# EAGLE design arduino (EAGLE 6.4)
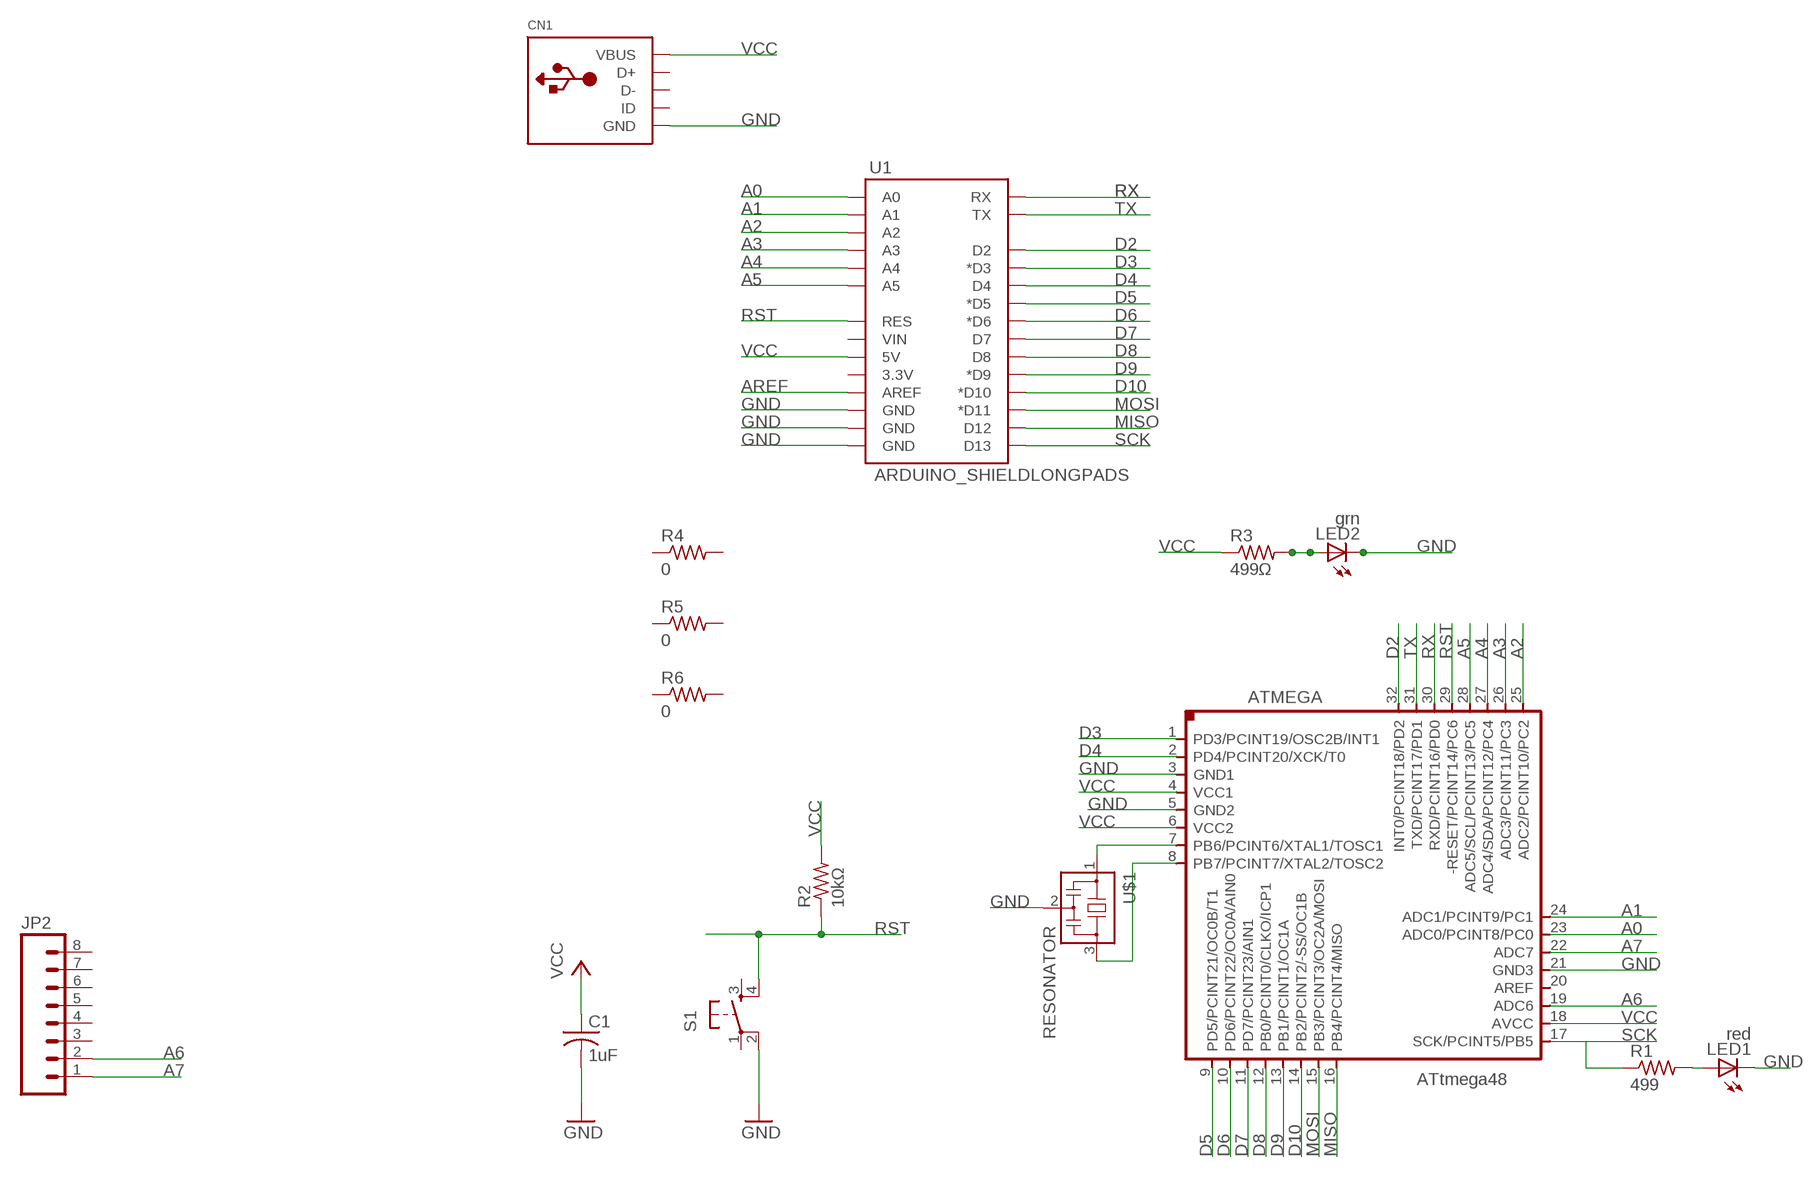
[diagram p0: schematic, sheet 1]

## Parts
ATMEGA  328p-au  ATMEGA48TQFP  [TQFP32-08]
C1  1uF  C-USC1206  [C1206]
CN1  USBMINIB  [USB-MINIB]
JP2  M08LOCK_LONGPADS  [1X08_LOCK_LONGPADS]
LED1  red  LEDCHIPLED_1206  [CHIPLED_1206]
LED2  grn  LEDCHIPLED_1206  [CHIPLED_1206]
R1  499  R-US_R1206  [R1206]
R2  10kΩ  R-US_M1206  [M1206]
R3  499Ω  R-US_M1206  [M1206]
R4  0  R-US_M1206  [M1206]
R5  0  R-US_M1206  [M1206]
R6  0  R-US_M1206  [M1206]
S1  6MM_SWITCH6MM_SWITCH  [6MM_SWITCH]
U1  ARDUINO_SHIELDLONGPADS  [DUEMILANOVE_SHIELD_LONGPADS]
U$1  RESONATOR  [EFOBM]

## Nets
A0: ATMEGA.23(ADC0/PCINT8/PC0) U1.A0
A1: ATMEGA.24(ADC1/PCINT9/PC1) U1.A1
A2: ATMEGA.25(ADC2/PCINT10/PC2) U1.A2
A3: ATMEGA.26(ADC3/PCINT11/PC3) U1.A3
A4: ATMEGA.27(ADC4/SDA/PCINT12/PC4) U1.A4
A5: ATMEGA.28(ADC5/SCL/PCINT13/PC5) U1.A5
A6: ATMEGA.19(ADC6) JP2.2
A7: ATMEGA.22(ADC7) JP2.1
AREF: U1.AREF
D2: ATMEGA.32(INT0/PCINT18/PD2) U1.D2
D3: ATMEGA.1(PD3/PCINT19/OSC2B/INT1) U1.D3(*D3)
D4: ATMEGA.2(PD4/PCINT20/XCK/T0) U1.D4
D5: ATMEGA.9(PD5/PCINT21/OC0B/T1) U1.D5(*D5)
D6: ATMEGA.10(PD6/PCINT22/OC0A/AIN0) U1.D6(*D6)
D7: ATMEGA.11(PD7/PCINT23/AIN1) U1.D7
D8: ATMEGA.12(PB0/PCINT0/CLKO/ICP1) U1.D8
D9: ATMEGA.13(PB1/PCINT1/OC1A) U1.D9(*D9)
D10: ATMEGA.14(PB2/PCINT2/-SS/OC1B) U1.D10(*D10)
GND: ATMEGA.3(GND1) ATMEGA.5(GND2) ATMEGA.21(GND3) C1.2 CN1.GND LED1.C LED2.C S1.2(P1) U1.GND@0(GND) U1.GND@1(GND) U1.GND@2(GND) U$1.2
MISO: ATMEGA.16(PB4/PCINT4/MISO) U1.D12
MOSI: ATMEGA.15(PB3/PCINT3/OC2A/MOSI) U1.D11(*D11)
N$2: LED1.A R1.2
N$5: ATMEGA.7(PB6/PCINT6/XTAL1/TOSC1) U$1.1
N$6: ATMEGA.8(PB7/PCINT7/XTAL2/TOSC2) U$1.3
N$7: LED2.A R3.2
RST: ATMEGA.29(-RESET/PCINT14/PC6) R2.1 S1.4(S1) U1.RES
RX: ATMEGA.30(RXD/PCINT16/PD0) U1.RX
SCK: ATMEGA.17(SCK/PCINT5/PB5) R1.1 U1.D13
TX: ATMEGA.31(TXD/PCINT17/PD1) U1.TX
VCC: ATMEGA.4(VCC1) ATMEGA.6(VCC2) ATMEGA.18(AVCC) C1.1 CN1.VBUS R2.2 R3.1 U1.5V
Unconnected: ATMEGA.20(AREF) CN1.D+ CN1.D- CN1.ID JP2.3 JP2.4 JP2.5 JP2.6 JP2.7 JP2.8 R4.1 R4.2 R5.1 R5.2 R6.1 R6.2 S1.1(P) S1.3(S) U1.3.3V U1.VIN

## Library data of the parts
ATMEGA = 01_ng:ATMEGA48
C1 = 01_adafruit:C-US: CAPACITOR, American symbol
CN1 = 01_adafruit:USB: USB Connectors USBMINIB - Surface Mount Female Mini-B USB Connector 4UConnector: 06564 By microbuilder.eu Thru-hole RA Female Mini-B USB Connector 4UConnector: 18732 By ladyada.net
JP2 = 01_SparkFun:M08: Header 8 Standard 8-pin 0.1" header. Use with straight break away headers (SKU : PRT-00116), right angle break away headers (PRT-00553), swiss pins (PRT-00743), machine pins (PRT-00117), and female headers (PRT-00115).
LED1 LED2 = 01_adafruit:LED: LED OSRAM: - CHIPLED LG R971, LG N971, LY N971, LG Q971, LY Q971, LO R971, LY R971 LH N974, LH R974 LS Q976, LO Q976, LY Q976 LO Q996 - Hyper CHIPLED LW Q18S LB Q993, LB Q99A, LB R99A - SideLED LS A670, LO A670, LY A670, LG A670, LP A670 LB A673, LV A673, LT A673, LW A673 LH A674 LY A675 LS A676, LA A676, LO A676, LY A676, LW A676 LS A679, LY A679, LG A679 - Hyper Micro SIDELED® LS Y876, LA Y876, LO Y876, LY Y876 LT Y87S - SmartLED LW L88C, LW L88S LB L89C, LB L89S, LG L890 LS L89K, LO L89K, LY L89K LS L896, LA L896, LO L896, LY L896 - TOPLED LS T670, LO T670, LY T670, LG T670, LP T670 LSG T670, LSP T670, LSY T670, LOP T670, LYG T670 LG T671, LOG T671, LSG T671 LB T673, LV T673, LT T673, LW T673 LH T674 LS T676, LA T676, LO T676, LY T676, LB T676, LH T676, LSB T676, LW T676 LB T67C, LV T67C, LT T67C, LS T67K, LO T67K, LY T67K, LW E67C LS E67B, LA E67B, LO E67B, LY E67B, LB E67C, LV E67C, LT E67C LW T67C LS T679, LY T679, LG T679 LS T770, LO T770, LY T770, LG T770, LP T770 LB T773, LV T773, LT T773, LW T773 LH T774 LS E675, LA E675, LY E675, LS T675 LS T776, LA T776, LO T776, LY T776, LB T776 LHGB T686 LT T68C, LB T68C - Hyper Mini TOPLED® LB M676 - Mini TOPLED Santana® LG M470 LS M47K, LO M47K, LY M47K Source: http://www.osram.convergy.de/
R1-R6 = 01_adafruit:R-US_: RESISTOR, American symbol
S1 = 01_FAB_Hello:6MM_SWITCH: OMRON SWITCH
U1 = SparkFun-Boards:ARDUINO_SHIELD: Arduino shield footprint
U$1 = 01_fab:RESONATOR

## Board
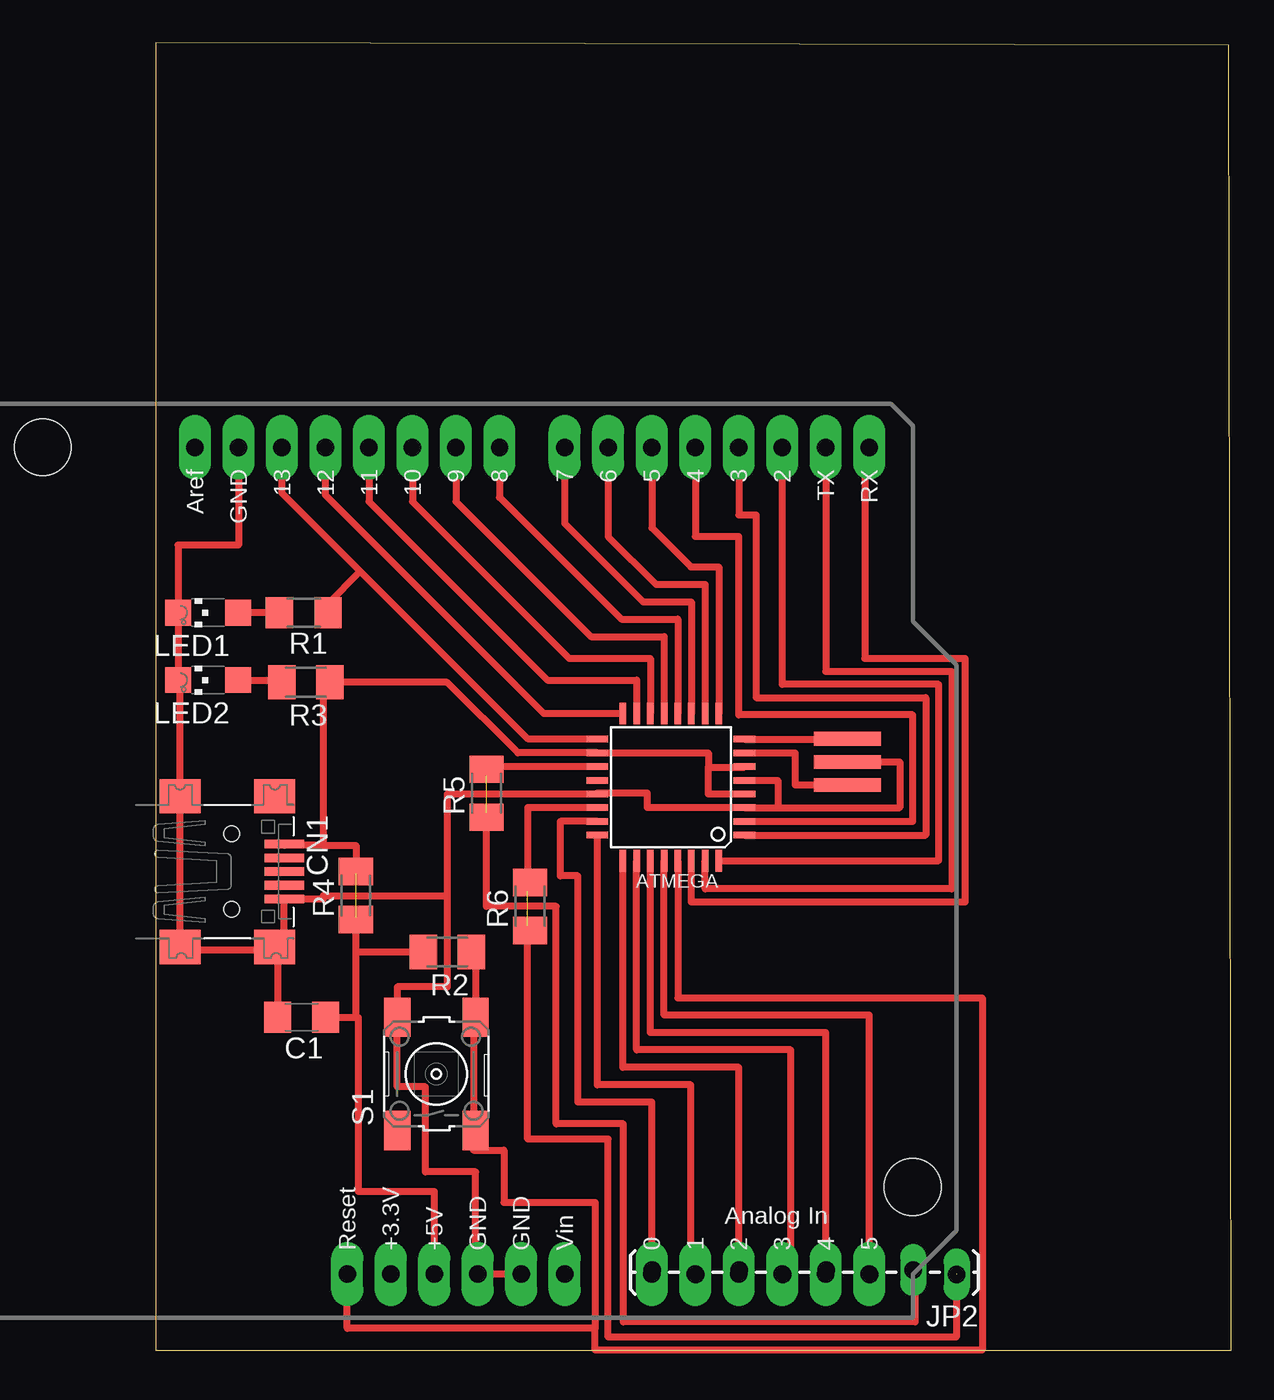
[diagram p1: board, top side]

Size 62.79 x 76.32 mm. Coordinates in mm from the lower left corner, seen from the top.
Outline: 0,0 62.79,0 62.66,76.19 0,76.32 0,0
Copper layers (1*16): Top 0.035mm / dielectric 1.5mm / Bottom 0.035mm
Design rules "default": minimum track width 10mil, minimum drill 24mil, track to track 8mil, track to pad 8mil, pad to pad 8mil, via to via 8mil, smd to smd 8mil, copper to edge 40mil, drill to drill 8mil, minimum pad ring 10mil, minimum via ring 8mil, stop-mask expansion 4mil, vias tented up to drill 0mil, thermal gap 10mil

### Footprints (pad centres in the part's own frame; a part is rotated, then mirrored left to right if it is on the bottom)
TQFP32-08 = smd 1.27 x 0.381: 1 -4.293,2.8; 2 -4.293,2; 3 -4.293,1.2; 4 -4.293,0.4; 5 -4.293,-0.4; 6 -4.293,-1.2; 7 -4.293,-2; 8 -4.293,-2.8; 17 4.293,-2.8; 18 4.293,-2; 19 4.293,-1.2; 20 4.293,-0.4; 21 4.293,0.4; 22 4.293,1.2; 23 4.293,2; 24 4.293,2.8 | smd 0.381 x 1.27: 9 -2.8,-4.293; 10 -2,-4.293; 11 -1.2,-4.293; 12 -0.4,-4.293; 13 0.4,-4.293; 14 1.2,-4.293; 15 2,-4.293; 16 2.8,-4.293; 25 2.8,4.293; 26 2,4.293; 27 1.2,4.293; 28 0.4,4.293; 29 -0.4,4.293; 30 -1.2,4.293; 31 -2,4.293; 32 -2.8,4.293
C1206 = smd 1.6 x 1.8: 1 -1.4,0; 2 1.4,0
USB-MINIB = smd 0.5 x 2.308: D+ 0,4.064; D- -0.8,4.064; GND 1.6,4.064; ID 0.8,4.064; VBUS -1.6,4.064 | smd 2 x 2.4: GND1 -4.4,-2; GND2 -4.4,3.5; GND3 4.4,3.5; GND4 4.4,-2 | hole 0.9: -2.2,1; 2.2,1
1X08_LOCK_LONGPADS = drill 1.016 long: 1 0,0.127; 2 2.54,-0.127; 3 5.08,0.127; 4 7.62,-0.127; 5 10.16,0.127; 6 12.7,-0.127; 7 15.24,0.127; 8 17.78,-0.127
CHIPLED_1206 = smd 1.5 x 1.5: A 0,-1.75; C 0,1.75
R1206 = smd 1.6 x 1.803: 1 -1.422,0; 2 1.422,0
M1206 = smd 1.6 x 2: 1 -1.4,0; 2 1.4,0
6MM_SWITCH = smd 2.286 x 1.524: 1 -3.302,2.286; 2 3.302,2.286; 3 -3.302,-2.286; 4 3.302,-2.286
DUEMILANOVE_SHIELD_LONGPADS = drill 1.016 pad 1.88 long: 3.3V 50.8,26.67; 5V 50.8,29.21; A0 50.8,41.91; A1 50.8,44.45; A2 50.8,46.99; A3 50.8,49.53; A4 50.8,52.07; A5 50.8,54.61; AREF 2.54,15.24; D2 2.54,49.53; D3 2.54,46.99; D4 2.54,44.45; D5 2.54,41.91; D6 2.54,39.37; D7 2.54,36.83; D8 2.54,33.02; D9 2.54,30.48; D10 2.54,27.94; D11 2.54,25.4; D12 2.54,22.86; D13 2.54,20.32; GND@0 50.8,31.75; GND@1 50.8,34.29; GND@2 2.54,17.78; RES 50.8,24.13; RX 2.54,54.61; TX 2.54,52.07; VIN 50.8,36.83 | hole 3.302: 45.72,57.15; 2.54,6.35
EFOBM = smd 0.8 x 3.9: 1 -1.35,0; 2 0,0; 3 1.35,0

### Placement (x,y rotation side)
ATMEGA  30.07,32.87 180 top
C1  8.51,19.43 180 top
CN1  3.43,27.94 270 top
JP2  46.76,4.55 180 top
LED1  3.05,43.05 90 top
LED2  3.05,39.12 90 top
R1  8.64,43.05 180 top
R2  17.02,23.24 180 top
R3  8.76,38.99 180 top
R4  11.68,26.54 90 top
R5  19.3,32.51 90 top
R6  21.84,25.91 90 top
S1  16.38,16.13 90 top
U1  -12.95,55.24 270 top
U$1  40.39,34.34 90 top

### Tracks (layer width: path | path; a pad name or v marks a point on that pad's centre or on a via)
A0
  Top 0.406: U1.A0 28.96,14.48 24.64,14.48 24.64,27.69 23.62,27.69 23.62,30.87 ATMEGA.23
A1
  Top 0.406: U1.A1 31.24,4.45 31.24,15.49 25.78,15.49 ATMEGA.24
A2
  Top 0.406: U1.A2 34.04,16.51 27.27,16.51 ATMEGA.25
A3
  Top 0.406: U1.A3 37.08,4.45 37.08,17.53 28.07,17.53 ATMEGA.26
A4
  Top 0.406: U1.A4 39.12,18.54 28.87,18.54 ATMEGA.27
A5
  Top 0.406: U1.A5 41.66,19.56 29.67,19.56 ATMEGA.28
A6  (1 unrouted)
  Top 0.406: ATMEGA.19 19.18,34.07 19.18,34.04 19.3,34.04 19.3,33.53 | JP2.2 44.32,4.67 44.32,1.65 27.3,1.65 27.3,13.21 23.37,13.21 23.37,25.91 19.3,25.91 19.3,31.37
A7  (2 unrouted)
  Top 0.406: 46.74,4.42 46.74,4.45 | ATMEGA.22 21.72,31.67 21.72,26.8 | JP2.1 46.74,4.42 | 46.74,4.42 46.74,0.76 26.42,0.76 26.42,12.32 21.72,12.32 21.72,24.77
D2
  Top 0.406: ATMEGA.32 45.72,28.57 45.72,38.86 36.58,38.86 U1.D2
D3
  Top 0.406: 34.04,52.83 U1.D3 34.04,48.77 35.05,48.77 35.05,38.1 44.96,38.1 44.96,30.07 ATMEGA.1
D4
  Top 0.406: U1.D4 31.5,47.5 34.04,47.5 34.04,37.08 44.2,37.08 44.2,30.87 ATMEGA.2
D5
  Top 0.406: U1.D5 28.96,48.01 31.24,45.72 32.87,45.72 ATMEGA.9
D6
  Top 0.406: U1.D6 26.42,47.5 29.21,44.7 32.07,44.7 ATMEGA.10
D7
  Top 0.406: U1.D7 23.88,48.26 28.45,43.69 31.27,43.69 ATMEGA.11
D8
  Top 0.406: U1.D8 20.07,49.78 27.18,42.67 30.47,42.67 ATMEGA.12
D9
  Top 0.406: U1.D9 17.53,49.53 25.4,41.66 29.67,41.66 ATMEGA.13
D10
  Top 0.406: U1.D10 14.99,49.53 24.13,40.39 28.87,40.39 ATMEGA.14
GND
  Top 0.406: U1.GND@1 U1.GND@0 18.8,4.83 18.67,4.83 18.67,10.41 15.75,10.41 15.75,15.37 14.1,15.37 S1.2 14.1,21.21 17.02,21.21 17.02,26.54 | 7.11,23.37 1.4,23.37 1.4,39.12 LED2.C LED1.C 1.3,46.99 4.83,46.99 U1.GND@2 | 7.11,23.37 7.49,23.37 CN1.GND 9.78,26.34 9.78,26.54 17.02,26.54 | 7.11,23.37 C1.2 | 17.02,26.54 17.02,32.47 ATMEGA.21 25.78,32.51 28.7,32.51 28.7,31.67 ATMEGA.3 36.32,31.67 | U$1.2 43.43,34.34 43.43,31.67 36.32,31.67 | ATMEGA.5 36.32,33.27 36.32,31.67
MISO
  Top 0.406: ATMEGA.16 22.66,37.16 9.91,49.91 U1.D12
MOSI
  Top 0.406: U1.D11 12.45,49.53 22.86,39.12 28.07,39.12 ATMEGA.15
N$2
  Top 0.406: R1.2 LED1.A
N$5
  Top 0.406: U$1.1 37.34,32.99 37.34,34.87 ATMEGA.7
N$6
  Top 0.406: ATMEGA.8 40.39,35.67 U$1.3
N$7
  Top 0.406: LED2.A 7.24,39.12 R3.2
RST
  Top 0.406: S1.4 18.67,23.24 R2.1 18.8,23.24 18.8,23.11 | S1.4 18.67,19.18 | 11.43,4.57 11.43,4.45 U1.RES 11.18,1.27 25.65,1.27 | S1.4 18.54,19.43 18.54,11.68 20.32,11.68 20.32,8.64 25.65,8.64 25.65,1.27 | ATMEGA.29 30.48,20.57 48.26,20.57 48.26,0 25.65,0 25.65,1.27
RX
  Top 0.406: U1.RX 41.4,52.7 41.4,40.39 47.24,40.39 47.24,26.16 31.27,26.16 ATMEGA.30
SCK
  Top 0.406: ATMEGA.17 21.74,35.67 11.94,45.47 | 11.94,45.47 7.37,50.04 U1.D13 | R1.1 10.06,43.59 11.94,45.47
TX
  Top 0.406: U1.TX 39.12,39.62 46.48,39.62 46.48,26.92 32.07,26.92 ATMEGA.31
VCC  (1 unrouted)
  Top 0.406: 32.26,34.04 32.26,34.87 ATMEGA.18 21.14,34.87 17.02,38.99 R3.1 10.16,39.24 9.78,39.24 9.78,29.46 | 32.26,34.04 34.37,34.04 ATMEGA.6 | ATMEGA.4 32.26,32.47 32.26,34.04 | 9.78,29.46 7.49,29.46 CN1.VBUS | R2.2 11.68,23.24 | 11.68,23.24 11.68,25.27 | 9.78,29.46 11.68,29.46 11.68,27.81 | C1.1 11.68,19.43 | 11.68,19.43 11.68,23.24 | 11.68,19.43 11.81,19.43 11.81,9.27 16.26,9.27 U1.5V